# Altium schematic sheet 00_POWER.SchDoc: Wearable Ultra Low-Power Ultrasound probe
size A3; DrawnBy: Sebastian Frey; Organization: Integrated Systems Laboratory; Revision: v1.2; SheetNumber: 1; SheetTotal: 6
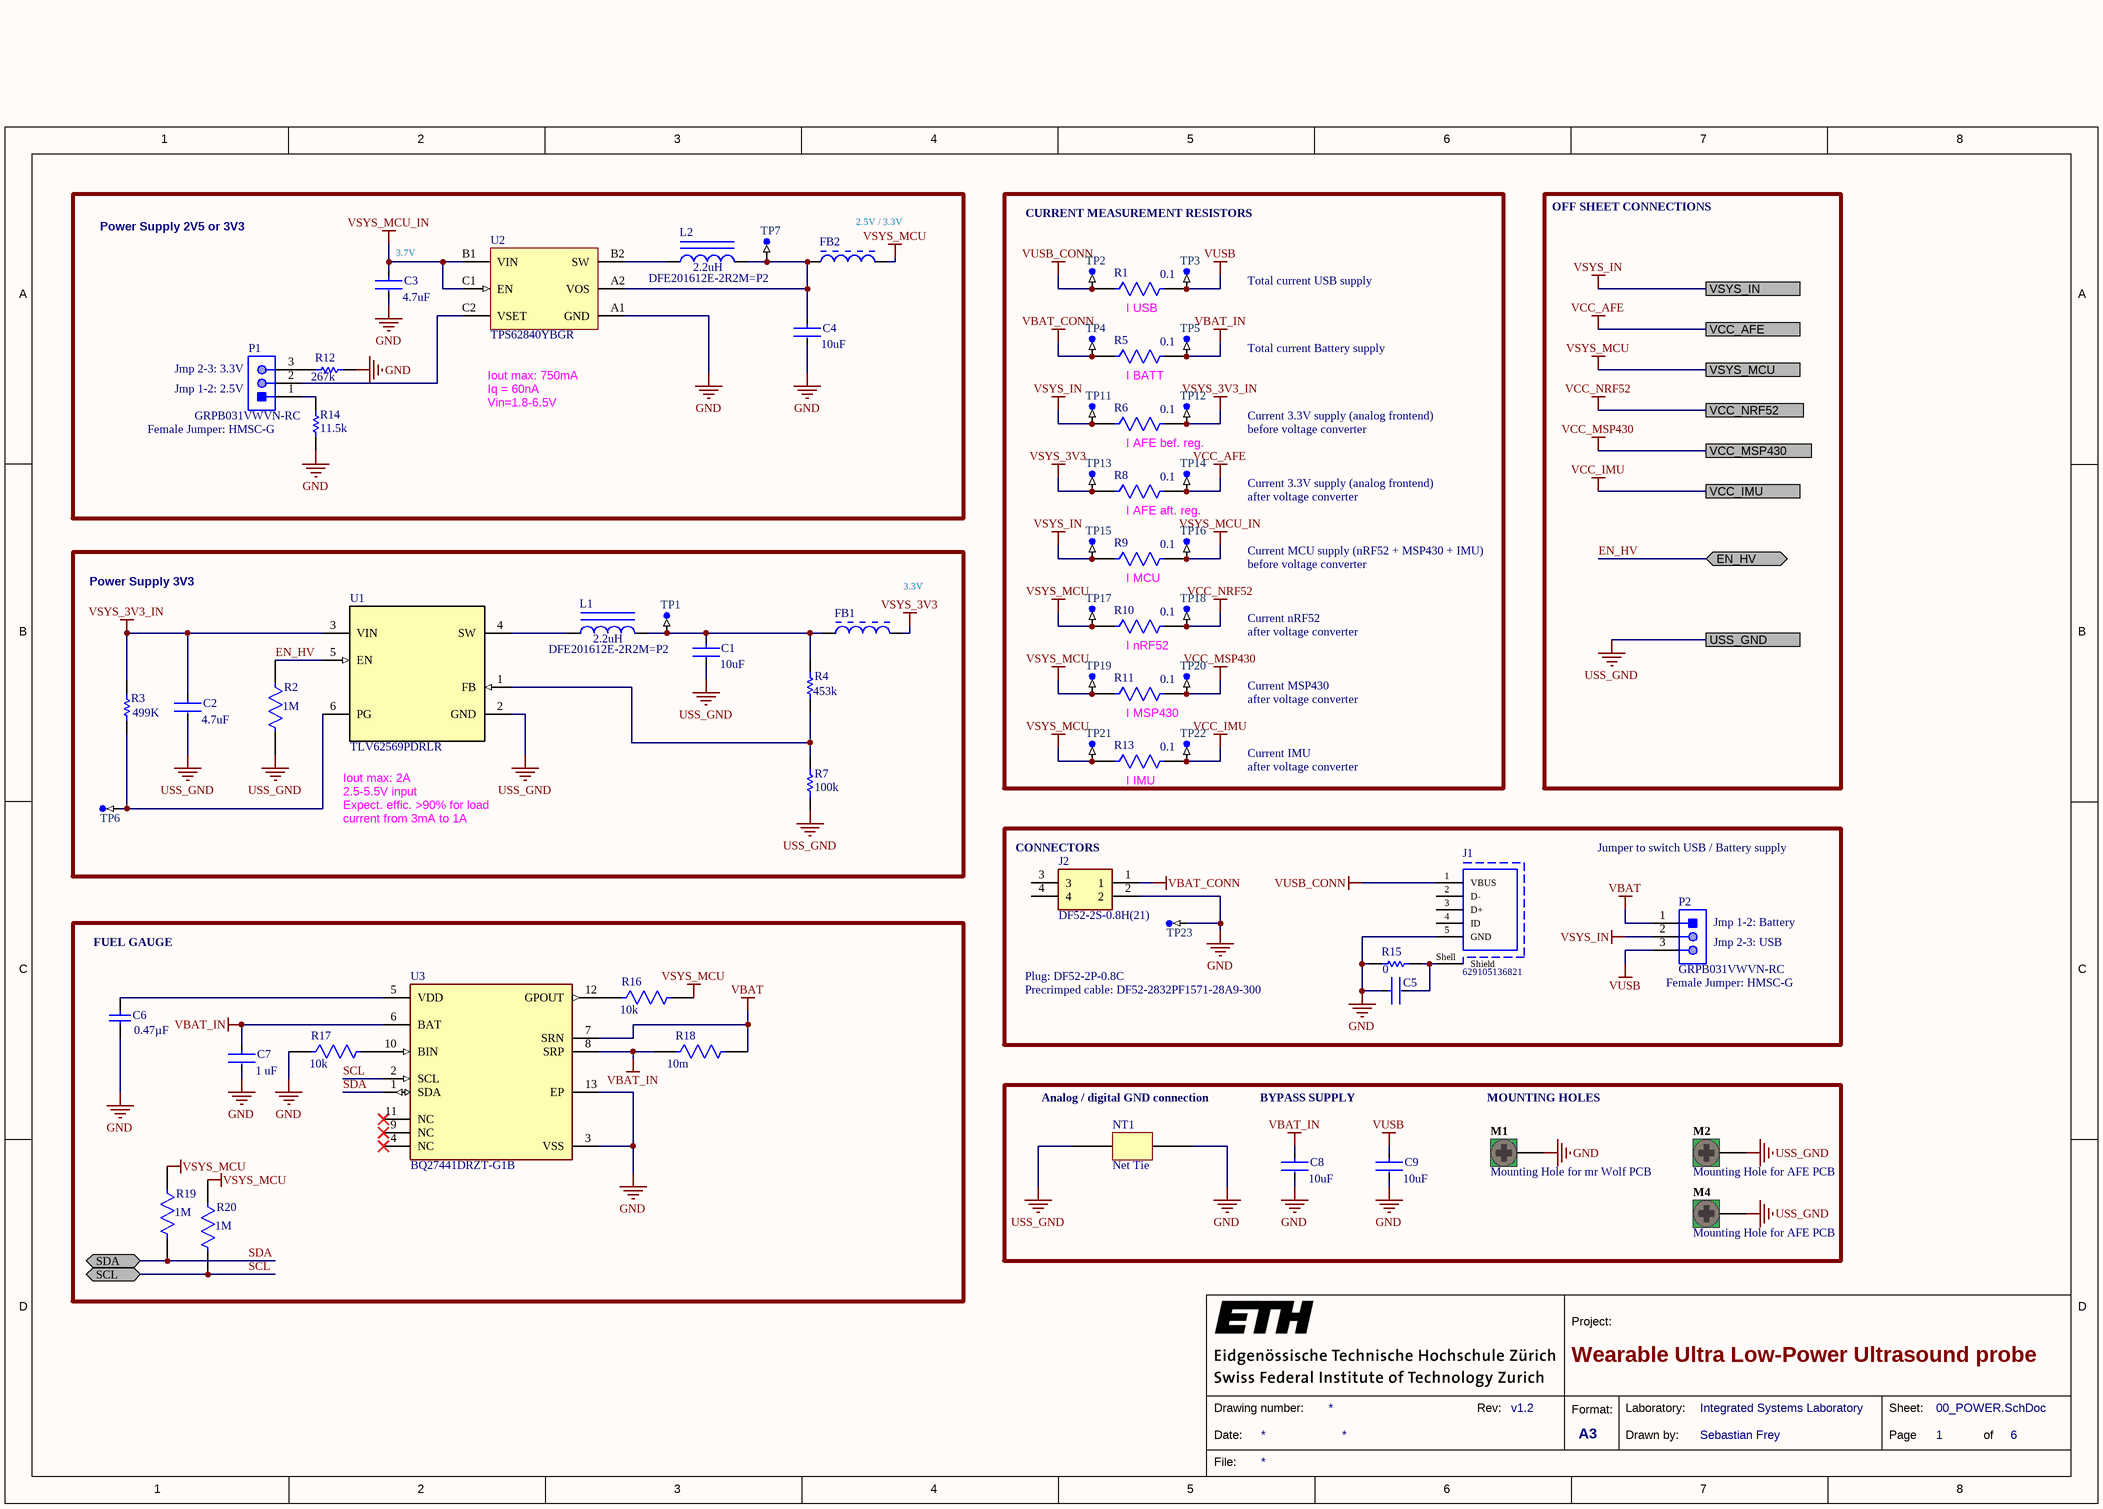
[diagram p0: 00_POWER.SchDoc]

## Parts
C1  value 10uF  [FP-C1608-080-MFG]  (hidden comment: C1608X5R1A106K080AC)
C2  Capacitance: 4.7uF  [FP-0603-L_1_6_0_15-W_0_8-IPC_A]  (hidden comment: EMK107ABJ475KA-T)
C3  Capacitance: 4.7uF  [FP-0603-L_1_6_0_15-W_0_8-IPC_A]  (hidden comment: EMK107ABJ475KA-T)
C4  value 10uF  [FP-C1608-080-MFG]  (hidden comment: C1608X5R1A106K080AC)
C5  CC0402KRX7R7BB104  [FP-CC0402-MFG]  (value not drawn)
C6  Capacitance: 0.47µF  [CAPC1050X55X10LL05]  (hidden comment: C1005X5R1E474K050BB)
C7  Capacitance: 1 uF  [FP-CC0402-MFG]  (hidden comment: CC0402KRX5R5BB105)
C8  value 10uF  [FP-C1608-080-MFG]  (hidden comment: C1608X5R1A106K080AC)
C9  value 10uF  [FP-C1608-080-MFG]  (hidden comment: C1608X5R1A106K080AC)
FB1  BLM03AX800SN1D  [MURA-BLM03-CHIP-2_V]  (value not drawn)
FB2  BLM03AX800SN1D  [MURA-BLM03-CHIP-2_V]  (value not drawn)
J1  629105136821  [629105136821]
J2  DF52-2S-0.8H(21)  [DF522S08H21]
L1  DFE201612E-2R2M=P2  value 2.2uH  [INDC2016X10L]
L2  DFE201612E-2R2M=P2  value 2.2uH  [INDC2016X10L]
M1  Mounting Hole for mr Wolf PCB  [Hole M2]  (no BOM)
M2  Mounting Hole for AFE PCB  [Hole M2]  (no BOM)
M4  Mounting Hole for AFE PCB  [Hole M2]  (no BOM)
NT1  Net Tie  [Net_Tie_Top_Bottom]  (net tie, no BOM)
P1  GRPB031VWVN-RC  [SLIN-GRPB031VWVN-RC_V]
P2  GRPB031VWVN-RC  [SLIN-GRPB031VWVN-RC_V]
R1  Resistance: 0.1  [FP-CSR0402-MFG]  (hidden comment: ERJ-2BWFR100X)
R2  Resistance: 1M  [FP-CR0402-MFG]  (hidden comment: CR0402-JW-105GLF)
R3  value 499K  [RESC0402(1005)_N]  (hidden comment: not mounted)
R4  Resistance: 453k  [RESC1005X40X25NL05T10]  (hidden comment: RC0402FR-07453KL)
R5  Resistance: 0.1  [FP-CSR0402-MFG]  (hidden comment: ERJ-2BWFR100X)
R6  Resistance: 0.1  [FP-CSR0402-MFG]  (hidden comment: ERJ-2BWFR100X)
R7  Resistance (Ohms): 100k  [RESC1005X40X25LL10T15]  (hidden comment: RMCF0402FT100K)
R8  Resistance: 0.1  [FP-CSR0402-MFG]  (hidden comment: ERJ-2BWFR100X)
R9  Resistance: 0.1  [FP-CSR0402-MFG]  (hidden comment: ERJ-2BWFR100X)
R10  Resistance: 0.1  [FP-CSR0402-MFG]  (hidden comment: ERJ-2BWFR100X)
R11  Resistance: 0.1  [FP-CSR0402-MFG]  (hidden comment: ERJ-2BWFR100X)
R12  Resistance: 267k  [RESC1005X40X25LL05T05]  (hidden comment: CRCW0402267KFKED)
R13  Resistance: 0.1  [FP-CSR0402-MFG]  (hidden comment: ERJ-2BWFR100X)
R14  Resistance: 11.5k  [RESC1005X40X25ML05T10]  (hidden comment: RC0402FR-0711K5L)
R15  Resistance: 0  [RESC1005X40X25NL05T10]  (hidden comment: RC0402JR-070RL)
R16  value 10k  [FP-TNPW0402-e3-MFG]  (hidden comment: TNPW040210K0BEED)
R17  value 10k  [FP-TNPW0402-e3-MFG]  (hidden comment: TNPW040210K0BEED)
R18  Resistance: 10m  [FP-CSRF0402-high-IPC_A]  (hidden comment: CSRF0402FT10L0)
R19  Resistance: 1M  [FP-CR0402-MFG]  (hidden comment: CR0402-JW-105GLF)
R20  Resistance: 1M  [FP-CR0402-MFG]  (hidden comment: CR0402-JW-105GLF)
TP1  TP-SM-C-100  [TP-SM-C-100]  (value not drawn)  (no BOM)
TP2  TP-SM-C-100  [TP-SM-C-100]  (value not drawn)  (no BOM)
TP3  TP-SM-C-100  [TP-SM-C-100]  (value not drawn)  (no BOM)
TP4  TP-SM-C-100  [TP-SM-C-100]  (value not drawn)  (no BOM)
TP5  TP-SM-C-100  [TP-SM-C-100]  (value not drawn)  (no BOM)
TP6  TP-SM-C-100  [TP-SM-C-100]  (value not drawn)  (no BOM)
TP7  TP-SM-C-100  [TP-SM-C-100]  (value not drawn)  (no BOM)
TP11  TP-SM-C-100  [TP-SM-C-100]  (value not drawn)  (no BOM)
TP12  TP-SM-C-100  [TP-SM-C-100]  (value not drawn)  (no BOM)
TP13  TP-SM-C-100  [TP-SM-C-100]  (value not drawn)  (no BOM)
TP14  TP-SM-C-100  [TP-SM-C-100]  (value not drawn)  (no BOM)
TP15  TP-SM-C-100  [TP-SM-C-100]  (value not drawn)  (no BOM)
TP16  TP-SM-C-100  [TP-SM-C-100]  (value not drawn)  (no BOM)
TP17  TP-SM-C-100  [TP-SM-C-100]  (value not drawn)  (no BOM)
TP18  TP-SM-C-100  [TP-SM-C-100]  (value not drawn)  (no BOM)
TP19  TP-SM-C-100  [TP-SM-C-100]  (value not drawn)  (no BOM)
TP20  TP-SM-C-100  [TP-SM-C-100]  (value not drawn)  (no BOM)
TP21  TP-SM-C-100  [TP-SM-C-100]  (value not drawn)  (no BOM)
TP22  TP-SM-C-100  [TP-SM-C-100]  (value not drawn)  (no BOM)
TP23  TP-SM-C-100  [TP-SM-C-100]  (value not drawn)  (no BOM)
U1  TLV62569PDRLR  [TLV62569PDRLR]
U2  TPS62840YBGR  [BGA6C40P2X3_97X147X50]
U3  BQ27441DRZT-G1B  [DRZ0012A_MFG]

## Blocks framed on the sheet
Power Supply 3V3: C1 C2 FB1 L1 R2-R4 R7 TP1 TP6 U1
FUEL GAUGE: C6 C7 R16-R20 U3

## Ports
EN_HV (bidir), SCL (bidir), SDA (bidir), USS_GND, VCC_AFE, VCC_IMU, VCC_MSP430, VCC_NRF52, VSYS_IN, VSYS_MCU

## Nets
GND: C3.2 C4.2 C5.1 C6.1 C7.2 C8.2 C9.2 J1.5(GND) J2.2 M1.1 NT1.2 R12.1 R14.1 R15.2 R17.1 TP23.1 U2.A1(GND) U3.3(VSS) U3.13(EP)
USS_GND: C1.2 C2.2 M2.1 M4.1 NT1.1 R2.2 R7.1 U1.2(GND) ; port USS_GND
VBAT: P2.1 R18.2 U3.7(SRN)
VBAT_CONN: J2.1 R5.1 TP4.1
VBAT_IN: C7.1 C8.1 R5.2 R18.1 TP5.1 U3.6(BAT) U3.8(SRP)
VCC_AFE: R8.2 TP14.1 ; port VCC_AFE
VCC_IMU: R13.2 TP22.1 ; port VCC_IMU
VCC_MSP430: R11.2 TP20.1 ; port VCC_MSP430
VCC_NRF52: R10.2 TP18.1 ; port VCC_NRF52
VSYS_3V3: FB1.2 R8.1 TP13.1
VSYS_3V3_IN: C2.1 R3.2 R6.2 TP12.1 U1.3(VIN)
VSYS_IN: P2.2 R6.1 R9.1 TP11.1 TP15.1 ; port VSYS_IN
VSYS_MCU: FB2.2 R10.1 R11.1 R13.1 R16.2 R19.1 R20.1 TP17.1 TP19.1 TP21.1 ; port VSYS_MCU
VSYS_MCU_IN: C3.1 R9.2 TP16.1 U2.B1(VIN) U2.C1(EN)
VUSB: C9.1 P2.3 R1.2 TP3.1
VUSB_CONN: J1.1(VBUS) R1.1 TP2.1
EN_HV: R2.1 U1.5(EN) ; port EN_HV
SCL: R20.2 U3.2(SCL) ; port SCL
SDA: R19.2 U3.1(SDA) ; port SDA
NetC1_1: C1.1 FB1.1 L1.2 R4.2 TP1.1
NetC4_1: C4.1 FB2.1 L2.2 TP7.1 U2.A2(VOS)
NetC5_2: C5.2 J1.Shell(Shield) R15.1
NetC6_2: C6.2 U3.5(VDD)
NetL1_1: L1.1 U1.4(SW)
NetL2_1: L2.1 U2.B2(SW)
NetP1_1: P1.1 R14.2
NetP1_2: P1.2 U2.C2(VSET)
NetP1_3: P1.3 R12.2
NetR3_1: R3.1 TP6.1 U1.6(PG)
NetR4_1: R4.1 R7.2 U1.1(FB)
NetR16_1: R16.1 U3.12(GPOUT)
NetR17_2: R17.2 U3.10(BIN)

Not connected (* = marked no-connect by the designer): J1 2(D-) 3(D+) 4(ID); J2 3 4; U3 4(NC)* 9(NC)* 11(NC)*

## Notes on the sheet
- Power Supply 2V5 or 3V3
- (near FB2) 2.5V / 3.3V
- CURRENT MEASUREMENT RESISTORS
- OFF SHEET CONNECTIONS
- (near C3) 3.7V
- (near R1) I USB
- Total current USB supply
- (near P1) Jmp 2-3: 3.3V
- (near R5) I BATT
- Total current Battery supply
- Female Jumper: HMSC-G
- (near P1) Jmp 1-2: 2.5V
- (near U2) Iout max: 750mA
  Iq = 60nA
  Vin=1.8-6.5V
- (near R6) I AFE bef. reg.
- Current 3.3V supply (analog frontend)
- before voltage converter
- (near R8) I AFE aft. reg.
- after voltage converter
- (near FB1) 3.3V
- (near R9) I MCU
- Current MCU supply (nRF52 + MSP430 + IMU)
- (near R10) I nRF52
- Current nRF52
- I MSP430
- Current MSP430
- (near R13) I IMU
- Current IMU
- Iout max: 2A
  2.5-5.5V input
  Expect. effic. >90% for load current from 3mA to 1A
- (near J2) CONNECTORS
- Jumper to switch USB / Battery supply
- Plug: DF52-2P-0.8C
- Precrimped cable: DF52-2832PF1571-28A9-300
- (near P2) Female Jumper: HMSC-G
- (near P2) Jmp 2-3: USB
- (near P2) Jmp 1-2: Battery
- (near NT1) Analog / digital GND connection
- BYPASS SUPPLY
- (near M1) MOUNTING HOLES
- 1
- 2
- 3
- 4
- 5
- 6
- 7
- 8
- A
- B
- C
- D
- Project:
- Date:
- Drawing number:
- Rev:
- Format:
- A3
- Drawn by:
- Laboratory:
- Page
- Sheet:
- of
- File:

## Library data of the parts
C1 C4 C8 C9 = CMP-2000-04979-2: CAP CER 10UF 10V X5R 0603; Manufacturer: TDK; Temperature Coefficient: 15%; Tolerance: 10%; Material: Ceramic; Mouser Description: CAP CER 10UF 10V X5R 0603; Package: C1608-080; Lead Free: Yes; Device Class L1: Passive Components; Temperature Range High: +85°C; Manufacturer Part Number: C1608X5R1A106K080AC; Octopart: https://octopart.com/c1608x5r1a106k080ac-tdk-26013468; Voltage: 10V; Footprint Url: https://product.tdk.com/info/en/catalog/spec/mlccspec_commercial_general_midvoltage_en.pdf; Ipc Land Pattern Name: CAPC16080X80; Temperature Range Low: -55°C; Temperature: -55°C to +85°C; ComponentLink2Description: Datasheet; ComponentLink2URL: https://product.tdk.com/info/en/documents/chara_sheet/C1608X5R1A106K080AC.pdf; Height: 0.9mm; Temperature Characteristic: X5R; RoHS: TRUE; Category: Cap; Capacitance: 10uF; Digikey Description: CAP CER 10UF 10V X5R 0603; Automotive: No; Device Class L3: Ceramic Capacitors; Device Class L2: Capacitors; Voltage Rating: 10V
C2 C3 = CMP-2000-06225-3: None; Voltage Rating (DC): 16V; Tolerance: 10%; Dielectric: X5R; Case/Package: 0603; Length: 1.6mm; Case Code (Imperial): 0603; Resistor Type: Ceramic; Packaging: Tape and Reel; Min Operating Temperature: -55°C; Series: M; Construction: Flat; Termination: SMD/SMT; Max Operating Temperature: 85°C; Voltage Rating: 16V; Width: 0.8mm; Case Code (Metric): 1608; Number of Pins: 2; RoHS Compliant: Yes; REACH SVHC: No SVHC; Package Quantity: 1; Thickness: 0.035inch; Height: 0.8mm; Mount: Surface Mount
C5 = CMP-03422-000048-1: CAP CER 0.1UF 16V X7R 0402; Manufacturer: YAGEO; Material: Ceramic; Automotive Grade: NA; Capacitance: 100 nF; Temperature Coefficient: 30ppm/°C; Tolerance: 0.1; Value: 100 nF; Device Class L1: Passive Components; Temperature Range Low: -55°C; Device Class L3: Ceramic Capacitors; Temperature Characteristic: X7R; Ipc Land Pattern Name: CAPC10050X50; Temperature Range High: +125°C; Voltage Rating: 16 V; Temperature: -55°C to +125°C; RoHS: TRUE; Automotive: No; Height: 0.55mm; Device Class L2: Capacitors; Digikey Description: CAP CER 0.1UF 16V X7R 0402; Package: CC0402; Footprint Url: http://www.yageo.com/exep/pages/download/literatures/UPY-C_GEN_24.pdf; ComponentLink2Description: Datasheet; Category: Cap; Lead Free: Yes; Octopart: https://octopart.com/cc0402krx7r7bb104-yageo-42244624; ComponentLink2URL: http://www.yageo.com/documents/recent/UPY-GP_NP0_16V-to-50V_16.pdf; Manufacturer Part Number: CC0402KRX7R7BB104; Mouser Description: 0402 0.1 uF 16 V ±10 % Tolerance X7R SMT Multilayer Ceramic Capacitor
C6 = CMP-2000-06003-1: Chip Capacitor, 0.47 uF, +/- 10%, 25 V, -55 to 85 degC, 0402 (1005 Metric), RoHS, Tape and Reel; PCN Part Number: MLCCPartNumberChange30/Nov/2012; Manufacturer: TDK; Kits: 445-9021-KIT-ND / -KITMLCC100PF-10UF04026.3-50V; Other Names: 445-8020-1; Temperature Coefficient: X5R; Voltage - Rated: 25V; Product Training Modules: CSeriesGeneralApplicationsSEAT,CCV,andTVCLDesignToolsGuidetoReplacinganElectrolyticCapacitorwithanMLCC; EDA / CAD Models: DownloadfromAcceleratedDesigns; Online Catalog: CSeries,GeneralPurpose; Datasheet URL: https://product.tdk.com/info/en/catalog/datasheets/mlcc_commercial_general_en.pdf; Size / Dimension: 0.039"Lx0.020"W(1.00mmx0.50mm); Category: Capacitors; Mounting Technology: SurfaceMount; Mounting Type: SurfaceMount,MLCC; Series: C; RoHS Information: RoHSCertificate-MLCC; Manufacturer URL: http://www.tdk.com/; Packaging: CutTape(CT); Features: LowESL; Package / Case: 0402(1005Metric); Package Reference: 0402; Family: CeramicCapacitors; Tolerance: ±10%; Datasheet Version: 08/2016; Package Description: 2-Pin Surface Mount Device, Body 1.00 x 0.50 mm; Operating Temperature: -55°C~85°C; Standard Package: 1; Applications: GeneralPurpose
C7 = CMP-2100-03591-2: CAP CER 1UF 6.3V X5R 0402; Manufacturer: YAGEO; Automotive Grade: NA; Material: Ceramic; Tolerance: 0.1; Temperature Coefficient: 30ppm/°C; Voltage Rating: 6.3 V; Temperature Range Low: -55°C; Digikey Description: CAP CER 1UF 6.3V X5R 0402; Height: 0.55mm; Automotive: No; ComponentLink2URL: http://www.yageo.com/documents/recent/UPY-GP_NP0_16V-to-50V_16.pdf; Device Class L2: Capacitors; RoHS: TRUE; Temperature Range High: +125°C; Device Class L3: Ceramic Capacitors; Device Class L1: Passive Components; Temperature Characteristic: X5R; Package: CC0402; Octopart: https://octopart.com/cc0402krx5r5bb105-yageo-42244618; ComponentLink2Description: Datasheet; Temperature: -55°C to +125°C; Manufacturer Part Number: CC0402KRX5R5BB105; Mouser Description: Multilayer Ceramic Capacitors MLCC - SMD/SMT 1uF 6.3V X5R 10%; Category: Cap; Footprint Url: http://www.yageo.com/exep/pages/download/literatures/UPY-C_GEN_24.pdf; Lead Free: Yes; Ipc Land Pattern Name: CAPC10050X50; Value: 1 uF
FB1 FB2 = CMP-0686-00058-2: Chip Ferrite Bead for Power lines and Signal Lines, 80 Ohm, 500 mA, -55 to 125 degC, 0.6 x 0.3 x 0.33 mm SMD, Tape and Reel; Manufacturer: Murata; DC Resistance: 0.18 Ohm Max.; Rated Current: 500 mA; Impedance (at 100 MHz): 80 Ohm +/- 25%; Material: Steel; Impedance: 80R; Current Rating: 500mA; DC Resistance (DCR): 180mR; Test Frequency: 100MHz; Tolerance: 25%; Number of Lines: 1; PackageReference: BLM03-2; ComponentLink2URL: http://www.murata.com/products/catalog/pdf/c31e.pdf; ComponentLink2Description: Datasheet; ComponentLink1Description: Manufacturer URL; DatasheetVersion: 08/2013; ComponentLink1URL: http://www.murata.com/; ComponentLink3Description: Package Specification; ComponentLink3URL: http://www.murata.com/products/catalog/pdf/c31e.pdf; PackageDescription: 2-Pin Chip, Body 0.6 x 0.3 mm; Packing: Tape and Reel; Operating Temperature Range: -55 to 125 degC; Mounting Technology: Surface Mount; PartNumber: BLM03AX800SN1D; Supplier 1: Digi-Key; Supplier Part Number 1: 490-5621-1-ND; Manufacturer Part Number: BLM03AX800SN1D; RoHS: Yes; Category: Inductors; Stock 1: 13310; Pricing 1: 1=0.19000, 10=0.15200, 25=0.11840, 50=0.09820, 100=0.08470, 250=0.06776, 500=0.06098, 1000=0.05082, 5000=0.04743 (USD); Case/Package: 0201; Number of Pins: 2; Case Code (Metric): 0603; Case Code (Imperial): 0201; Min Operating Temperature: -55°C; Max Operating Temperature: 125°C; Package Quantity: 1; Packaging: Tape and Reel; Max DC Current: 500mA; Termination: SMD/SMT; Max Current Rating: 500mA; Number of Circuits: 1; Length: 0.6mm; Height: 0.3mm; Width: 0.3mm; REACH SVHC: No SVHC; ComponentLink4URL: https://datasheet.ciiva.com/1013/l0110s0100blm03ax-1013986.pdf?src-supplier=Digi-Key; ComponentLink4Description: https://datasheet.ciiva.com/1013/l0110s0100blm03ax-1013986.pdf?src-supplier=Digi-Key; ComponentLink5URL: https://datasheet.ciiva.com/41449/001172131-da-01-en-drossel-0201-80r-0-6x0-3mm-15000st-41449422.pdf?src-supplier=Conrad; ComponentLink5Description: https://datasheet.ciiva.com/41449/001172131-da-01-en-drossel-0201-80r-0-6x0-3mm-15000st-41449422.pdf?src-supplier=Conrad; ComponentLink6URL: https://datasheet.ciiva.com/1013/l0110e-1013987.pdf?src-supplier=Digi-Key; ComponentLink6Description: https://datasheet.ciiva.com/1013/l0110e-1013987.pdf?src-supplier=Digi-Key; ComponentLink7URL: https://datasheet.ciiva.com/1013/l0110e-1013988.pdf?src-supplier=Digi-Key; ComponentLink7Description: https://datasheet.ciiva.com/1013/l0110e-1013988.pdf?src-supplier=Digi-Key; ComponentLink8URL: https://datasheet.ciiva.com/46423/1851884-46423882.pdf?src-supplier=Element14; ComponentLink8Description: https://datasheet.ciiva.com/46423/1851884-46423882.pdf?src-supplier=Element14
J1 = CMP-1502-03253-1: Micro USB 2.0 Type B Receptacle WR-COM, Horizontal, SMT, with Pads and Pegs; Manufacturer: Wurth Elektronik; Contact Resistance: 30mOhm; Rated Current: 1A; Working Voltage: 30VAC; Datasheet URL: https://katalog.we-online.de/em/datasheet/629105136821.pdf; Mounting Technology: SMT; Publisher: WurthElektronik; Package Reference: 629105136821; Orientation: Horizontal; Packaging: TapeandReel; Part Number: 629105136821; Manufacturer URL: http://www.we-online.de; Connector Type: MicroUSB2.0TypeB; Gender: Receptacle; Operating Temperature: -40to105degC
J2 = DF52-2S-0.8H_21_: Connector; Manufacturer_Name: Hirose; Datasheet Link: https://datasheet.datasheetarchive.com/originals/distributors/DKDS-30/591726.pdf; Height: 1mm; Manufacturer_Part_Number: DF52-2S-0.8H(21); Mouser Part Number: 798-DF52-2S-0.8H21; Mouser Price/Stock: https://www.mouser.co.uk/ProductDetail/Hirose-Connector/DF52-2S-0.8H21?qs=%2FKR40Cd6GUpAHUMGMtWbig%3D%3D
L1 L2 = CMP-01651-1: 2.2µH Shielded Wirewound Inductor 1.8A 116mOhm Max 0806 (2016 Metric); Manufacturer: Murata Electronics; Inductance: 2,2µH; Current Rating (Amps): 1,8A; Tolerance: ±20%; Material - Core: Metal; Current - Saturation: 2.4A; Inductance Frequency - Test: 1MHz; DC Resistance (DCR): 116mOhm Max; Ratings: -; Series: DFE201612E; Operating Temperature: -40°C ~ 125°C; Features: -; Package / Case: 0806 (2016 Metric); Q @ Freq: -; Packaging: Tape & Reel (TR); Mounting Type: Surface Mount; Frequency - Self Resonant: -; Part Status: Active; Shielding: Shielded; Type: Wirewound; Supplier Device Package: 0806; Manufacturer Part Number: DFE201612E-2R2M=P2
M1 M2 M4 = CMP-00274-1: M2 Hole, 2.4mm drill, 5mm landing pads, 3mm pad in middle layers, no overlay; ClassName: Mounting Hole
NT1 = Net_Tie
P1 P2 = CMP-2000-06372-1: Male Header, Pitch 1.27 mm, 1 x 3 Position, Height 4 mm, Tail Length 2.3 mm, -40 to 105 degC, RoHS, Bulk; Manufacturer: Sullins; Other Names: S9014E-03; Number of Positions: 3; Connector Type: Header,Unshrouded; Pitch: 0.050"(1.27mm); Dynamic Catalog: GRPB; Catalog Drawings: S9014ESeriesTop; Mating Products: S9010E-03-ND / -CONNHEADER.050"3POSR/APCB / S9008E-03-ND / -CONNHEADER.050"3POSPCBGOLD / S9005E-03-ND / -CONNHEADER.050"3POSSMDGOLD; Number of Positions Loaded: All; Contact Finish: Gold; Mounting Type: ThroughHole; Termination: Solder; Packaging: Bulk; Category: Connectors,Interconnects; Package Description: Male Header, Pitch 1.27 mm, 1 x 3 Position, Height 4 mm, Tail Length 2.3 mm; Standard Package: 1; Datasheet URL: http://www.sullinscorp.com/drawings/71_GRPB___1VWVN-RC,_10957-C.pdf; Package Reference: GRPB031VWVN-RC; Family: RectangularConnectors-Headers,MalePins; Number of Rows: 1; Contact Type: MalePin; Manufacturer URL: http://www.sullinscorp.com/; Mounting Technology: ThroughHole; Contact Mating Length: 0.118"(3.00mm); Contact Finish Thickness: Flash; Datasheet Version: Rev. C, 12/2008
R1 R5 R6 R8-R11 R13 = CMP-26527-000038-1: RES 0.1 OHM 1% 1/4W 0402; Max Power Dissipation: 250mW; Temperature Coefficient: 200ppm/°C; Max Operating Temperature: 155°C; RoHS Compliant: Yes; Case Code (Imperial): 0402; Package Quantity: 1000; Mount: Surface Mount; Width: 0.02inch; Case/Package: 0402; Packaging: Tape and Reel; Resistor Type: Thick Film; Tolerance: 1%; Length: 0.039inch; Case Code (Metric): 1005; Min Operating Temperature: -55°C; Number of Terminations: 2; Series: CSR; Height: 0.017inch
R2 R19 R20 = CMP-2002-05525-2: Thick Film Chip Resistors 0402 1MΩ 0.0625W 5% 200ppm/°C; Voltage Rating: 50V; Max Power Dissipation: 63mW; Power Rating: 62.5mW; Case/Package: 0402; Depth: 0.5mm; Case Code (Imperial): 0402; Width: 0.02inch; Length: 1mm; Tolerance: 5%; Min Operating Temperature: -55°C; Number of Terminations: 2; Thickness: 356um; Case Code (Metric): 1005; Radiation Hardening: No; Height: 0.016inch; Military Standard: Not; Mount: Surface Mount; Termination: SMD/SMT; Composition: Thick Film; Temperature Coefficient: 200ppm/°C; Contact Plating: Tin; Packaging: Tape and Reel; Package Quantity: 10000; Max Operating Temperature: 125°C
R3 = CMP-1011-00815-1: 499K 0.063W 1% 0402 (1005 Metric)  SMD; Case-EIA: 0402; Case-Metric: 1005; Tolerance: 1 %; Power: 0.063 W; Technology: SMT
R4 = CMP-2002-07690-1: Manufacturer: Yageo; Part Number: RC0402FR-07453KL
R7 = CMP-2000-06984-1: Chip Resistor, 100 KOhm, +/- 1%, 63 mW, -55 to 155 degC, 0402 (1005 Metric), RoHS, Tape and Reel; Manufacturer: Stackpole-Electronics-Inc.; Temperature Coefficient: ±100ppm/°C; Power (Watts): 0.063W,1/16W; Category: Resistors; Mounting Technology: SurfaceMount; Family: ChipResistor-SurfaceMount; Package / Case: 0402(1005Metric); Supplier Device Package: 0402; Features: AutomotiveAEC-Q200; Package Reference: 0402; Operating Temperature: -55°C~155°C; Series: RMCF; Number of Terminations: 2; Package Description: 2-Pin Surface Mount Device, Body 1 x 0.5 mm; Datasheet Version: 01/2017; Tolerance: ±1%; Composition: ThickFilm; Packaging: CutTape(CT); Manufacturer URL: https://www.seielect.com/; Datasheet URL: https://www.seielect.com/Catalog/SEI-RMCF_RMCP.pdf
R12 = CMP-2002-08420-1: Manufacturer: Vishay Dale; Part Number: CRCW0402267KFKED
R14 = CMP-2002-07364-1: Manufacturer: Yageo / Phycomp; Part Number: RC0402FR-0711K5L
R15 = CMP-1011-00001-2: Manufacturer: Yageo / Phycomp; Part Number: RC0402JR-070RL
R16 R17 = CMP-2002-01683-2: RES 10K OHM 0.1% 1/10W 0402; Manufacturer: Vishay; Power Rating: 0.1W; Temperature Coefficient: 25ppm/°C; Automotive Grade: Grade 0; Voltage Rating: 50V; Resistance: 10kΩ; Automotive: Yes; Digikey Description: RES 10K OHM 0.1% 1/10W 0402; Device Class L2: Resistors; Manufacturer Part Number: TNPW040210K0BEED; Temperature: -55°C to +155°C; ComponentLink2Description: Datasheet; Ipc Land Pattern Name: RESC10050X35; Temperature Range High: +155°C; Composition: Thin Film; Tolerance: 0.1%; Device Class L3: Chip SMD Resistors; Package: TNPW0402-e3; Octopart: https://octopart.com/tnpw040210k0beed-vishay-41229038; Device Class L1: Passive Components; Series: TNPW; Temperature Range Low: -55°C; Height: 0.4mm; Category: Res; Lead Free: Yes; RoHS: TRUE; ComponentLink2URL: http://www.vishay.com/docs/28758/tnpw_e3.pdf
R18 = CMP-26527-000102-1: RES 0.01 OHM 1% 1/8W 0402; Max Power Dissipation: 125mW; Temperature Coefficient: 200ppm/°C; Features: Moisture Resistant; Case Code (Metric): 1005; Packaging: Cut Tape; Max Operating Temperature: 170°C; Lead Free: Lead Free; Length: 0.039inch; RoHS Compliant: Yes; Case Code (Imperial): 0402; Min Operating Temperature: -55°C; Mount: Surface Mount; Height: 0.022inch; Package Quantity: 1; Series: CSRF; Number of Terminations: 2; Resistor Type: Metal Foil; Width: 0.022inch; Tolerance: 1%; Case/Package: 0402
TP1-TP7 TP11-TP23 = CMP-0484-00002-1: Test Point, Surface Mount, Circular, Pad Diameter 1 mm
U1 = TLV62569PDRLR: 2.5V-5.5V input, 2-A high efficiency step-down buck converter in SOT23 and SOT563 package 6-SOT-5X3 -40 to 125; Manufacturer: Texas Instruments; Supplier 1: Digi-Key; Manufacturer Part Number: TLV62569PDRLR; RoHS: Yes; Category: Voltage Regulators - Switching; Pricing 1: 1=0.60000, 10=0.52500, 25=0.49280, 100=0.40230, 250=0.37364, 500=0.31800, 1000=0.26250 (USD); Min Operating Temperature: -40°C; Max Operating Temperature: 125°C; RoHS Compliant: Yes; ComponentLink1URL: http://www.ti.com/general/docs/suppproductinfo.tsp?distId=10&amp;gotoUrl=http%3A%2F%2Fwww.ti.com%2Flit%2Fgpn%2Ftlv62569&src-supplier=Digi-Key; ComponentLink1Description: http://www.ti.com/general/docs/suppproductinfo.tsp?distId=10&amp;gotoUrl=http%3A%2F%2Fwww.ti.com%2Flit%2Fgpn%2Ftlv62569&src-supplier=Digi-Key; ComponentLink2URL: http://www.ti.com/lit/ds/symlink/tlv62569.pdf?src-supplier=Digi-Key; ComponentLink2Description: http://www.ti.com/lit/ds/symlink/tlv62569.pdf?src-supplier=Digi-Key; Supplier Part Number 1: 296-50408-1-ND
U2 = CMP-01223-1: Switching Voltage Regulators 60-nA IQ, 1.8-V to 6.5-VIN, high-efficiency 750-mA step-down converter 6-DSBGA -40 to 125; Output Voltage: 1.8 V to 3.3 V; Input Voltage MIN: 1.8 V; Input Voltage: 1.8 V to 6.5 V; Input Voltage MAX: 6.5 V; Brand: Texas Instruments; Switching Frequency: 1.8 MHz; Output Current: 750 mA; Number of Outputs: 1 Output; Topology: Buck; Quiescent Current: 60 nA; Factory Pack Quantity: 3000; Minimum Operating Temperature: - 40 C; Maximum Operating Temperature: + 125 C; Series: TPS62840; Package/Case: DSBGA-6; Shutdown: Shutdown; Manufacturer: Texas Instruments; Mounting Style: SMD/SMT; Type: Step-Down Converter; Supply Voltage - Min: 1.8 V; Product Type: Switching Voltage Regulators; Subcategory: PMIC - Power Management ICs; Product Category: Switching Voltage Regulators
U3 = BQ27441DRZT-G1B: System-side Impedance Track™ battery fuel (gas) gauge 12-SON -40 to 85; Manufacturer: Texas Instruments; Number of Cells: 1; Interface: I2C; Min Supply Voltage: 2.45V; Max Supply Voltage: 4.5V; Output Voltage: 1.8V; Operating Supply Current: 93uA; Capacity: 8000mAh; Output Current: 500uA; Supplier 1: Mouser; Manufacturer Part Number: BQ27441DRZT-G1B; RoHS: Yes; Category: Battery Management; Stock 1: 456; Pricing 1: 1=3.05000, 10=2.74000, 50=2.59000, 100=2.25000, 1000=2.12000, 10000=2.12000 (USD); Mount: Surface Mount; Number of Pins: 12; Contact Plating: Gold; Min Operating Temperature: -40°C; Max Operating Temperature: 85°C; Package Quantity: 250; Packaging: Tape and Reel; REACH SVHC: No SVHC; Lead Free: Lead Free; RoHS Compliant: Yes; ComponentLink1URL: https://datasheet.ciiva.com/46405/1795843-46405045.pdf?src-supplier=Element14; ComponentLink1Description: https://datasheet.ciiva.com/46405/1795843-46405045.pdf?src-supplier=Element14; Supplier Part Number 1: 595-BQ27441DRZT-G1B